# Altium schematic sheet IPBUS_mezzanine.SchDoc
size A3; SheetNumber: 1; SheetTotal: 1
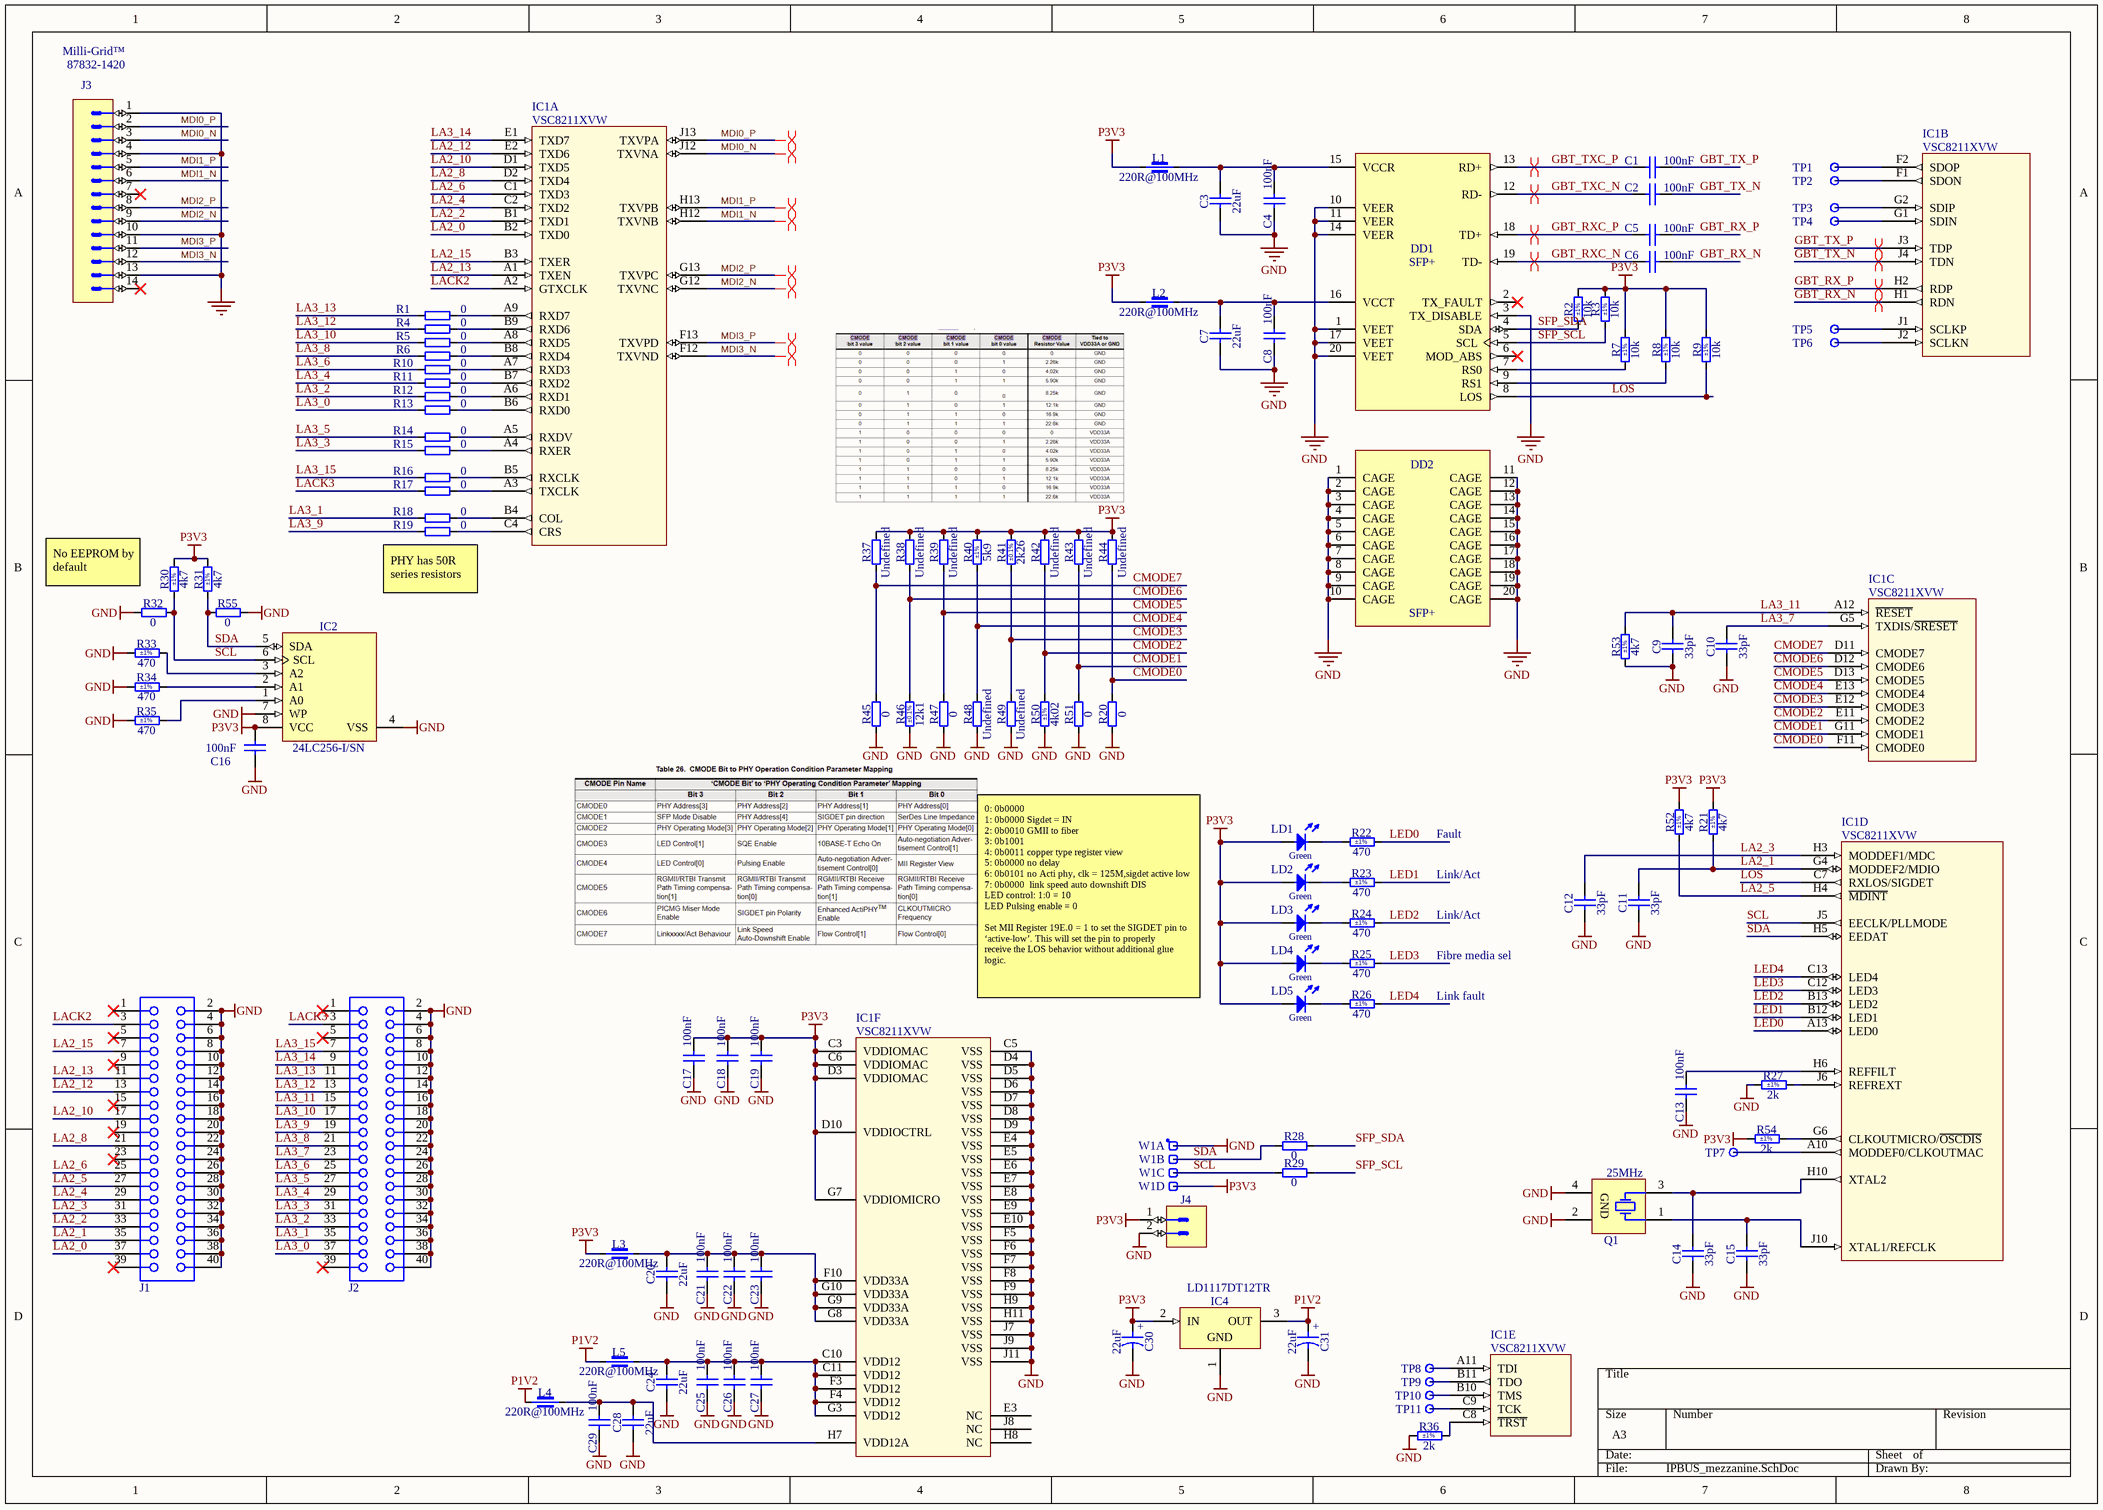
[diagram p0: IPBUS_mezzanine.SchDoc]

## Parts
C1  100nF  [CAPC1005X55N]
C2  100nF  [CAPC1005X55N]
C3  22uF  [CAPC3216X180N]
C4  100nF  [CAPC1005X55N]
C5  100nF  [CAPC1005X55N]
C6  100nF  [CAPC1005X55N]
C7  22uF  [CAPC3216X180N]
C8  100nF  [CAPC1005X55N]
C9  33pF  [CAPC1005X55N]
C10  33pF  [CAPC1005X55N]
C11  33pF  [CAPC1005X55N]
C12  33pF  [CAPC1005X55N]
C13  100nF  [CAPC1005X55N]
C14  33pF  [CAPC1005X55N]
C15  33pF  [CAPC1005X55N]
C16  100nF  [CAPC1005X55N]
C17  100nF  [CAPC1005X55N]
C18  100nF  [CAPC1005X55N]
C19  100nF  [CAPC1005X55N]
C20  22uF  [CAPC3216X180N]
C21  100nF  [CAPC1005X55N]
C22  100nF  [CAPC1005X55N]
C23  100nF  [CAPC1005X55N]
C24  22uF  [CAPC3216X180N]
C25  100nF  [CAPC1005X55N]
C26  100nF  [CAPC1005X55N]
C27  100nF  [CAPC1005X55N]
C28  22uF  [CAPC3216X180N]
C29  100nF  [CAPC1005X55N]
C30  22uF  [CAPMP3528X210N]
C31  22uF  [CAPMP3528X210N]
DD1  SFP+  [AMPHENOL_UE76A203000]
DD2  SFP+  [AMPHENOL_U77A16131001]
IC1  VSC8211XVW  [BGA117C100P13X9_1400X1000X170]  (parts A,B,C,D,E,F of 6)
IC2  24LC256-I/SN  [SOIC127P600X175-8N]
IC4  LD1117DT12TR  [TO228P972X240-3N-R540X510]
J1  61304021821  [61304021821]  (value not drawn)
J2  61304021821  [61304021821]  (value not drawn)
J3  Milli-Grid™  Manufacturer Part Number: 87832-1420  [MOLEX_87832-1420]
J4  KK®  [MOLEX_22-05-7028]  (value not drawn)
L1  220R@100MHz  [INDC1608X95N]
L2  220R@100MHz  [INDC1608X95N]
L3  220R@100MHz  [INDC1608X95N]
L4  220R@100MHz  [INDC1608X95N]
L5  220R@100MHz  [INDC1608X95N]
LD1  Green  [LED_AVAGO_HSME-C120]
LD2  Green  [LED_AVAGO_HSME-C120]
LD3  Green  [LED_AVAGO_HSME-C120]
LD4  Green  [LED_AVAGO_HSME-C120]
LD5  Green  [LED_AVAGO_HSME-C120]
Q1  25MHz  [XTAL_TXC_8Y]
R1  0  [RESC1005X40N]
R2  10k  Tolerance: ±1%  [RESC1608X55N]
R3  10k  Tolerance: ±1%  [RESC1608X55N]
R4  0  [RESC1005X40N]
R5  0  [RESC1005X40N]
R6  0  [RESC1005X40N]
R7  10k  Tolerance: ±1%  [RESC1608X55N]
R8  10k  Tolerance: ±1%  [RESC1608X55N]
R9  10k  Tolerance: ±1%  [RESC1608X55N]
R10  0  [RESC1005X40N]
R11  0  [RESC1005X40N]
R12  0  [RESC1005X40N]
R13  0  [RESC1005X40N]
R14  0  [RESC1005X40N]
R15  0  [RESC1005X40N]
R16  0  [RESC1005X40N]
R17  0  [RESC1005X40N]
R18  0  [RESC1005X40N]
R19  0  [RESC1005X40N]
R20  0  [RESC1608X55N]
R21  4k7  Tolerance: ±1%  [RESC1608X55N]
R22  470  Tolerance: ±1%  [RESC1608X55N]
R23  470  Tolerance: ±1%  [RESC1608X55N]
R24  470  Tolerance: ±1%  [RESC1608X55N]
R25  470  Tolerance: ±1%  [RESC1608X55N]
R26  470  Tolerance: ±1%  [RESC1608X55N]
R27  2k  Tolerance: ±1%  [RESC1608X55N]
R28  0  [RESC1608X55N]
R29  0  [RESC1608X55N]
R30  4k7  Tolerance: ±1%  [RESC1608X55N]
R31  4k7  Tolerance: ±1%  [RESC1608X55N]
R32  0  [RESC1608X55N]
R33  470  Tolerance: ±1%  [RESC1608X55N]
R34  470  Tolerance: ±1%  [RESC1608X55N]
R35  470  Tolerance: ±1%  [RESC1608X55N]
R36  2k  Tolerance: ±1%  [RESC1608X55N]
R37  Undefined  [RESC1608X55N]
R38  Undefined  [RESC1608X55N]
R39  Undefined  [RESC1608X55N]
R40  5k9  Tolerance: ±1%  [RESC1608X55N]
R41  2k26  Tolerance: ±0.1%  [RESC1608X55N]
R42  Undefined  [RESC1608X55N]
R43  Undefined  [RESC1608X55N]
R44  Undefined  [RESC1608X55N]
R45  0  [RESC1608X55N]
R46  12k1  Tolerance: ±0.1%  [RESC1608X55N]
R47  0  [RESC1608X55N]
R48  Undefined  [RESC1608X55N]
R49  Undefined  [RESC1608X55N]
R50  4k02  Tolerance: ±1%  [RESC1608X55N]
R51  0  [RESC1608X55N]
R52  4k7  Tolerance: ±1%  [RESC1608X55N]
R53  4k7  Tolerance: ±1%  [RESC1608X55N]
R54  2k  Tolerance: ±1%  [RESC1608X55N]
R55  0  [RESC1608X55N]
TP1  SMD Pad  [C60]  (value not drawn)
TP2  SMD Pad  [C60]  (value not drawn)
TP3  SMD Pad  [C60]  (value not drawn)
TP4  SMD Pad  [C60]  (value not drawn)
TP5  SMD Pad  [C60]  (value not drawn)
TP6  SMD Pad  [C60]  (value not drawn)
TP7  SMD Pad  [C60]  (value not drawn)
TP8  SMD Pad  [C60]  (value not drawn)
TP9  SMD Pad  [C60]  (value not drawn)
TP10  SMD Pad  [C60]  (value not drawn)
TP11  SMD Pad  [C60]  (value not drawn)
W1  Header 4  [SAMTEC_HTSW-104-23-L-S]  (value not drawn)  (parts A,B,C,D of 4)

## Nets
GND: C3.1 C4.1 C7.1 C8.1 C9.1 C10.1 C11.1 C12.1 C13.1 C14.1 C15.1 C16.1 C17.1 C18.1 C19.1 C20.1 C21.1 C22.1 C23.1 C24.1 C25.1 C26.1 C27.1 C28.1 C29.1 C30.2 C31.2 DD1.1(VEET) DD1.3(TX_DISABLE) DD1.10(VEER) DD1.11(VEER) DD1.14(VEER) DD1.17(VEET) DD1.20(VEET) DD2.1(CAGE) DD2.2(CAGE) DD2.3(CAGE) DD2.4(CAGE) DD2.5(CAGE) DD2.6(CAGE) DD2.7(CAGE) DD2.8(CAGE) DD2.9(CAGE) DD2.10(CAGE) DD2.11(CAGE) DD2.12(CAGE) DD2.13(CAGE) DD2.14(CAGE) DD2.15(CAGE) DD2.16(CAGE) DD2.17(CAGE) DD2.18(CAGE) DD2.19(CAGE) DD2.20(CAGE) IC1.C5(VSS) IC1.D4(VSS) IC1.D5(VSS) IC1.D6(VSS) IC1.D7(VSS) IC1.D8(VSS) IC1.D9(VSS) IC1.E4(VSS) IC1.E5(VSS) IC1.E6(VSS) IC1.E7(VSS) IC1.E8(VSS) IC1.E9(VSS) IC1.E10(VSS) IC1.F5(VSS) IC1.F6(VSS) IC1.F7(VSS) IC1.F8(VSS) IC1.F9(VSS) IC1.H9(VSS) IC1.H11(VSS) IC1.J7(VSS) IC1.J9(VSS) IC1.J11(VSS) IC2.4(VSS) IC2.7(WP) IC4.1(GND) J1.2 J1.4 J1.6 J1.8 J1.10 J1.12 J1.14 J1.16 J1.18 J1.20 J1.22 J1.24 J1.26 J1.28 J1.30 J1.32 J1.34 J1.36 J1.38 J1.40 J2.2 J2.4 J2.6 J2.8 J2.10 J2.12 J2.14 J2.16 J2.18 J2.20 J2.22 J2.24 J2.26 J2.28 J2.30 J2.32 J2.34 J2.36 J2.38 J2.40 J3.1 J3.4 J3.10 J3.13 J4.2 Q1.2(GND) Q1.4(GND) R20.1 R27.1 R32.1 R33.1 R34.1 R35.1 R36.1 R45.1 R46.1 R47.1 R48.1 R49.1 R50.1 R51.1 R53.1 R55.2 W1.1
P1V2: C31.1 IC4.3(OUT) L4.1 L5.1
P3V3: C16.2 C17.2 C18.2 C19.2 C30.1 IC1.C3(VDDIOMAC) IC1.C6(VDDIOMAC) IC1.D3(VDDIOMAC) IC1.D10(VDDIOCTRL) IC1.G7(VDDIOMICRO) IC2.8(VCC) IC4.2(IN) J4.1 L1.1 L2.1 L3.1 LD1.2(A) LD2.2(A) LD3.2(A) LD4.2(A) LD5.2(A) R2.2 R3.2 R7.2 R8.2 R9.2 R21.2 R30.2 R31.2 R37.2 R38.2 R39.2 R40.2 R41.2 R42.2 R43.2 R44.2 R52.2 R54.1 W1.4
CMODE0: IC1.F11(CMODE0) R20.2 R44.1
CMODE1: IC1.G11(CMODE1) R43.1 R51.2
CMODE2: IC1.E11(CMODE2) R42.1 R50.2
CMODE3: IC1.E12(CMODE3) R41.1 R49.2
CMODE4: IC1.E13(CMODE4) R40.1 R48.2
CMODE5: IC1.D13(CMODE5) R39.1 R47.2
CMODE6: IC1.D12(CMODE6) R38.1 R46.2
CMODE7: IC1.D11(CMODE7) R37.1 R45.2
GBT_RX_N: C6.2 IC1.H1(RDN)
GBT_RX_P: C5.2 IC1.H2(RDP)
GBT_RXC_N: C6.1 DD1.19(TD-)
GBT_RXC_P: C5.1 DD1.18(TD+)
GBT_TX_N: C2.2 IC1.J4(TDN)
GBT_TX_P: C1.2 IC1.J3(TDP)
GBT_TXC_N: C2.1 DD1.12(RD-)
GBT_TXC_P: C1.1 DD1.13(RD+)
LA2_0: IC1.B2(TXD0) J1.37
LA2_1: C11.2 IC1.G4(MODDEF2/MDIO) J1.35 R21.1
LA2_2: IC1.B1(TXD1) J1.33
LA2_3: C12.2 IC1.H3(MODDEF1/MDC) J1.31
LA2_4: IC1.C2(TXD2) J1.29
LA2_5: IC1.H4(~{MDINT}) J1.27 R52.1
LA2_6: IC1.C1(TXD3) J1.25
LA2_8: IC1.D2(TXD4) J1.21
LA2_10: IC1.D1(TXD5) J1.17
LA2_12: IC1.E2(TXD6) J1.13
LA2_13: IC1.A1(TXEN) J1.11
LA2_15: IC1.B3(TXER) J1.7
LA3_0: J2.37 R13.1
LA3_1: J2.35 R18.1
LA3_2: J2.33 R12.1
LA3_3: J2.31 R15.1
LA3_4: J2.29 R11.1
LA3_5: J2.27 R14.1
LA3_6: J2.25 R10.1
LA3_7: C10.2 IC1.G5(TXDIS/~{SRESET}) J2.23
LA3_8: J2.21 R6.1
LA3_9: J2.19 R19.1
LA3_10: J2.17 R5.1
LA3_11: C9.2 IC1.A12(~{RESET}) J2.15 R53.2
LA3_12: J2.13 R4.1
LA3_13: J2.11 R1.1
LA3_14: IC1.E1(TXD7) J2.9
LA3_15: J2.7 R16.1
LACK2: IC1.A2(GTXCLK) J1.3
LACK3: J2.3 R17.1
LED0: IC1.A13(LED0) R22.2
LED1: IC1.B12(LED1) R23.2
LED2: IC1.B13(LED2) R24.2
LED3: IC1.C12(LED3) R25.2
LED4: IC1.C13(LED4) R26.2
LOS: DD1.8(LOS) IC1.C7(RXLOS/SIGDET) R9.1
MDI0_N: IC1.J12(TXVNA) J3.3
MDI0_P: IC1.J13(TXVPA) J3.2
MDI1_N: IC1.H12(TXVNB) J3.6
MDI1_P: IC1.H13(TXVPB) J3.5
MDI2_N: IC1.G12(TXVNC) J3.9
MDI2_P: IC1.G13(TXVPC) J3.8
MDI3_N: IC1.F12(TXVND) J3.12
MDI3_P: IC1.F13(TXVPD) J3.11
SCL: IC1.J5(EECLK/PLLMODE) IC2.6(SCL) R29.1 R30.1 R32.2 W1.3
SDA: IC1.H5(EEDAT) IC2.5(SDA) R28.1 R31.1 R55.1 W1.2
SFP_SCL: DD1.5(SCL) R3.1 R29.2
SFP_SDA: DD1.4(SDA) R2.1 R28.2
NetC3_2: C3.2 C4.2 DD1.15(VCCR) L1.2
NetC7_2: C7.2 C8.2 DD1.16(VCCT) L2.2
NetC13_2: C13.2 IC1.H6(REFFILT)
NetC14_2: C14.2 IC1.H10(XTAL2) Q1.3(X)
NetC15_2: C15.2 IC1.J10(XTAL1/REFCLK) Q1.1(X)
NetC20_2: C20.2 C21.2 C22.2 C23.2 IC1.F10(VDD33A) IC1.G8(VDD33A) IC1.G9(VDD33A) IC1.G10(VDD33A) L3.2
NetC24_2: C24.2 C25.2 C26.2 C27.2 IC1.C10(VDD12) IC1.C11(VDD12) IC1.F3(VDD12) IC1.F4(VDD12) IC1.G3(VDD12) L5.2
NetC28_2: C28.2 C29.2 IC1.H7(VDD12A) L4.2
NetDD1_7: DD1.7(RS0) R7.1
NetDD1_9: DD1.9(RS1) R8.1
NetIC1_A3: IC1.A3(TXCLK) R17.2
NetIC1_A4: IC1.A4(RXER) R15.2
NetIC1_A5: IC1.A5(RXDV) R14.2
NetIC1_A6: IC1.A6(RXD1) R12.2
NetIC1_A7: IC1.A7(RXD3) R10.2
NetIC1_A8: IC1.A8(RXD5) R5.2
NetIC1_A9: IC1.A9(RXD7) R1.2
NetIC1_A10: IC1.A10(MODDEF0/CLKOUTMAC) TP7.1
NetIC1_A11: IC1.A11(TDI) TP8.1
NetIC1_B4: IC1.B4(COL) R18.2
NetIC1_B5: IC1.B5(RXCLK) R16.2
NetIC1_B6: IC1.B6(RXD0) R13.2
NetIC1_B7: IC1.B7(RXD2) R11.2
NetIC1_B8: IC1.B8(RXD4) R6.2
NetIC1_B9: IC1.B9(RXD6) R4.2
NetIC1_B10: IC1.B10(TMS) TP10.1
NetIC1_B11: IC1.B11(TDO) TP9.1
NetIC1_C4: IC1.C4(CRS) R19.2
NetIC1_C8: IC1.C8(~{TRST}) R36.2
NetIC1_C9: IC1.C9(TCK) TP11.1
NetIC1_F1: IC1.F1(SDON) TP2.1
NetIC1_F2: IC1.F2(SDOP) TP1.1
NetIC1_G1: IC1.G1(SDIN) TP4.1
NetIC1_G2: IC1.G2(SDIP) TP3.1
NetIC1_G6: IC1.G6(CLKOUTMICRO/~{OSCDIS}) R54.2
NetIC1_J1: IC1.J1(SCLKP) TP5.1
NetIC1_J2: IC1.J2(SCLKN) TP6.1
NetIC1_J6: IC1.J6(REFREXT) R27.2
NetIC2_1: IC2.1(A0) R35.2
NetIC2_2: IC2.2(A1) R34.2
NetIC2_3: IC2.3(A2) R33.2
NetLD1_1: LD1.1(C) R22.1
NetLD2_1: LD2.1(C) R23.1
NetLD3_1: LD3.1(C) R24.1
NetLD4_1: LD4.1(C) R25.1
NetLD5_1: LD5.1(C) R26.1

Not connected (* = marked no-connect by the designer): DD1 2(TX_FAULT)* 6(MOD_ABS)*; IC1 E3(NC) H8(NC) J8(NC); J1 1* 5* 9* 15* 19* 23* 39*; J2 1* 5* 39*; J3 7* 14*

## Layout directives
differential pair: GBT_RX_N, GBT_RX_P, GBT_RXC_N, GBT_RXC_P, GBT_TX_N, GBT_TX_P, GBT_TXC_N, GBT_TXC_P, MDI0_N, MDI0_P, MDI1_N, MDI1_P, MDI2_N, MDI2_P, MDI3_N, MDI3_P

## Notes on the sheet
- No EEPROM by default
- (near R19) PHY has 50R series resistors
- Fault
- Link/Act
- 0: 0b0000
  1: 0b0000 Sigdet = IN
  2: 0b0010 GMII to fiber
  3: 0b1001
  4: 0b0011 copper type register view
  5: 0b0000 no delay
  6: 0b0101 no Acti phy, clk = 125M,sigdet active low
  7: 0b0000  link speed auto downshift DIS
  LED control: 1:0 = 10
  LED Pulsing enable = 0
  Set MII Register 19E.0 = 1 to set the SIGDET pin to ‘active-low’. This will set the pin to properly
  receive the LOS behavior without additional glue logic.
- Fibre media sel
- Link fault
- (in symbol CTE3528-21_22UF_10V_10%_LESR0700) +

## Library data of the parts
C1 C2 C4-C6 C8 C13 C16-C19 C21-C23 C25-C27 C29 = CC0402_100NF_16V_10%_X5R: Non-polarised capacitor; Part Description: SMD Multilayer Chip Ceramic Capacitor; Manufacturer: GENERIC; Manufacturer1 Part Number: GRM155R61C104KA88D; Voltage: 16V; TC: X5R; Tolerance: ±10%; Part Number: CC0402_100NF_16V_10%_X5R; Component Kind: Standard; Component Type: Standard; Pin Count: 2; Value: 100nF; Status: None; Manufacturer Part Number: CC0402_100NF_16V_10%_X5R; Case: 0402; Mounted: Yes; Socket: No; SMD: Yes; Sense: No; Manufacturer1 Example: MURATA; Manufacturer1 ComponentHeight: 0.55mm; HelpURL: \\cern.ch\dfs\Applications\Altium\Datasheets\CC0402_X5R_MURATA_GRM.pdf; Author: CERN DEM JLC; CreateDate: 10.12.2013; LatestRevisionDate: 10.12.2013
C3 C7 C20 C24 C28 = CC1206_22UF_25V_20%_X5R: Non-polarised capacitor; Part Description: SMD Multilayer Chip Ceramic Capacitor; Manufacturer: GENERIC; Manufacturer1 Part Number: C3216X5R1E226M160; Voltage: 25V; TC: X5R; Tolerance: ±20%; Part Number: CC1206_22UF_25V_20%_X5R; Component Kind: Standard; Component Type: Standard; Pin Count: 2; Value: 22uF; Status: None; Manufacturer Part Number: CC1206_22UF_25V_20%_X5R; Case: 1206; Mounted: Yes; Socket: No; SMD: Yes; Sense: No; Manufacturer1 Example: TDK; Manufacturer1 ComponentHeight: 1.8mm; HelpURL: \\cern.ch\dfs\Applications\Altium\Datasheets\CC1206_X5R_TDK_C.pdf; Author: CERN DEM WB; CreateDate: 25.07.2018; LatestRevisionDate: 25.07.2018
C9-C12 C14 C15 = CC0402_33PF_50V_5%_C0G: Non-polarised capacitor; Part Description: SMD Multilayer Chip Ceramic Capacitor; Manufacturer: GENERIC; Manufacturer1 Part Number: C0402C330J5GACTU; Voltage: 50V; TC: C0G/NP0; Tolerance: ±5%; Part Number: CC0402_33PF_50V_5%_C0G; Component Kind: Standard; Component Type: Standard; Pin Count: 2; Value: 33pF; Status: Preferred; Manufacturer Part Number: CC0402_33PF_50V_5%_C0G; Case: 0402; Mounted: Yes; Socket: No; SMD: Yes; Sense: No; Manufacturer1 Example: KEMET; Manufacturer1 ComponentHeight: 0.55mm; HelpURL: \\cern.ch\dfs\Applications\Altium\Datasheets\CC0402_C0G_KEMET_(Commercial Grade).pdf; Author: CERN DEM JLC; CreateDate: 03.12.2007; LatestRevisionDate: 22.04.2015
C30 C31 = CTE3528-21_22UF_10V_10%_LESR0700: Polarised capacitor; Part Description: Low ESR 0R7 Solid Tantalum Chip Capacitor; Manufacturer: GENERIC; Manufacturer1 Part Number: TPSB226K010R0700; Voltage: 10V; Tolerance: ±10%; Part Number: CTE3528-21_22UF_10V_10%_LESR0700; Component Kind: Standard; Component Type: Standard; Pin Count: 2; Value: 22uF; Status: Preferred; Manufacturer Part Number: CTE3528-21_22UF_10V_10%_LESR0700; Case: B; Mounted: Yes; Socket: No; SMD: Yes; Sense: No; Manufacturer1 Example: AVX; Manufacturer1 ComponentHeight: 2.1mm; HelpURL: \\cern.ch\dfs\Applications\Altium\Datasheets\CTE-LESR_AVX_TPS.pdf; Author: CERN DEM JLC; CreateDate: 05.05.2008; LatestRevisionDate: 20.01.2009
DD1 = AMPHENOL_UE76A203000: 20 Position SFP+ Connector (Small Form-factor Pluggable); Part Description: 20 Position, Pitch 0.8mm SFP+ High Speed Connector Receptacle (Small Form-factor Pluggable); PressFit: No; Part Number: AMPHENOL_UE76A203000; Component Kind: Standard; Component Type: Standard; Pin Count: 20; Family: SFP+; Mounted: Yes; Socket: No; SMD: Yes; Sense: No; Status: None; Manufacturer: AMPHENOL; Manufacturer Part Number: UE76A203000; ComponentHeight: 5.25mm; HelpURL: \\cern.ch\dfs\Applications\Altium\Datasheets\AMPHENOL_UE76A203000.pdf; Author: CERN DEM BC; CreateDate: 04.09.2020; LatestRevisionDate: 04.09.2020
DD2 = AMPHENOL_U77A16131001: SFP+ 1x1 Cage (20Pins); Part Description: 1x1 Cage For Use with SFP+ Connector (Small Form-factor Pluggable); PressFit: No; Part Number: AMPHENOL_U77A16131001; Component Kind: Standard; Component Type: Standard; Pin Count: 20; Family: SFP+; Mounted: Yes; Socket: No; SMD: No; Sense: No; Status: None; Manufacturer: AMPHENOL; Manufacturer Part Number: U77A16131001; ComponentHeight: 9.7mm; HelpURL: \\cern.ch\dfs\Applications\Altium\Datasheets\AMPHENOL_U77A16131001.pdf; Author: CERN DEM BC; CreateDate: 03.09.2020; LatestRevisionDate: 03.09.2020
IC1 = VSC8211XVW: Single Port 10/100/1000BASE-T PHY and 1000BASE-X PHY with SGMII, SerDes, GMII, MII, TBI, RGMII / RTBI MAC Interfaces; Manufacturer: VITESSE SEMICONDUCTOR; PressFit: No; Bonding: No; Part Number: VSC8211XVW; Component Kind: Standard; Component Type: Standard; Device: VSC8211XVW; PackageDescription: BGA, 1.00mm Pitch, Rect.; 117 Pin, 13 Columns X 9 Rows, 14.0mm L X 10.0mm W X 1.70mm H body, IPC Medium Density; Part Description: Single Port 10/100/1000BASE-T PHY and 1000BASE-X PHY with SGMII, SerDes, GMII, MII, TBI, RGMII / RTBI MAC Interfaces; Manufacturer Part Number: VSC8211XVW; Pin Count: 117; Case: BGA117; Mounted: Yes; Socket: No; SMD: Yes; Sense: No; ComponentHeight: 1.7mm; Author: CERN DEM JLC; HelpURL: \\cern.ch\dfs\Applications\Altium\Datasheets\VSC8211XVW.pdf; CreateDate: 16.08.2011; LatestRevisionDate: 16.08.2011
IC2 = 24LC256-I/SN: 2.5V-5.5V, 256K (32k x 8-bit) I2C Serial EEPROM; Manufacturer: MICROCHIP TECHNOLOGY; PressFit: No; Bonding: No; Part Number: 24LC256-I/SN; Component Kind: Standard; Component Type: Standard; Device: 24LC256-I/SN; PackageDescription: SOIC, 1.27mm Pitch; 8 Pin - Body 4x5mm, IPC Medium Density; Part Description: 2.5V-5.5V, 256K (32k x 8-bit) I2C Serial EEPROM; Manufacturer Part Number: 24LC256-I/SN; Pin Count: 8; Case: SOIC8; Mounted: Yes; Socket: No; SMD: Yes; Sense: No; ComponentHeight: 1.75mm; HelpURL: \\cern.ch\dfs\Applications\Altium\Datasheets\24LC256-I-SN.pdf; Author: CERN DEM JLC; CreateDate: 04.09.2012; LatestRevisionDate: 04.09.2012
IC4 = LD1117DT12TR: 3-Terminal Regulator 1=GND 2=IN 3=OUT; Part Description: 1.2V 800mA Low drop fixed and adjustable positive voltage regulators; Manufacturer: ST MICROELECTRONICS; PressFit: No; Bonding: No; Part Number: LD1117DT12TR; Component Kind: Standard; Component Type: Standard; Device: LD1117DT12TR; PackageDescription: TO-252 DPAK TO, 2.28mm Pitch; 2 Pin, 9.725mm L X 6.10mm W X 2.40mm H body, IPC Medium Density; Manufacturer Part Number: LD1117DT12TR; Pin Count: 3; Case: DPAK; Mounted: Yes; Socket: No; SMD: Yes; Sense: No; ComponentHeight: 2.4mm; HelpURL: \\cern.ch\dfs\Applications\Altium\Datasheets\LD1117DT12TR.pdf; Author: CERN DEM JLC; CreateDate: 02.09.2009; LatestRevisionDate: 21.09.2009
J1 J2 = 61304021821: WR-PHD Socket Header, THT, Vertical, pitch 2.54mm, 2 Row, 40P; Manufacturer: Wurth Elektronik; Contact Resistance: 20mOhm; Rated Current: 3A; Working Voltage: 250V; Withstanding Voltage: 500V; Manufacturer Part Number: 61304021821; Category: Board-to-Board Connectors; Match Code: WR-PHD; ComponentLink1Description: Website Link; ComponentLink1URL: https://www.we-online.com/redexpert/article/61304021821?ad; ComponentLink2Description: Datasheet Link; ComponentLink2URL: https://www.we-online.com/redexpert/spec/61304021821?ad; Mount: Through Hole; Operating Temperature Max: 125°C; Operating Temperature Min: -40°C; Packaging: Tray; Gender: Socket Header; Number of Pins: 40; Number of Rows: 2; Orientation: Vertical; Pitch: 2.54mm
J3 = MOLEX_87832-1420: Connector 14 Male; Manufacturer: MOLEX; Part Description: 2.00mm (.079") Pitch Milli-Grid™ Header, Surface Mount, Vertical, Shrouded, 14 Circuits,with Locking Windows and Centre Polarization Slot, PCB Locator; PressFit: No; Part Number: MOLEX_87832-1420; Component Kind: Standard; Component Type: Standard; Pin Count: 14; Family: Milli-Grid™; Mounted: Yes; Socket: No; SMD: Yes; Sense: No; Status: None; ComponentHeight: 7.6mm; HelpURL: \\cern.ch\dfs\Applications\Altium\Datasheets\MOLEX_87832-1420.pdf; Author: CERN DEM JLC; CreateDate: 09.09.2008; LatestRevisionDate: 09.09.2008
J4 = MOLEX_22-05-7028: Connector 2 Male; Part Description: 2.54mm (.100") Pitch KK® Wire-To-Board Header, Right Angle, with Friction Lock, 2 Circuits; Manufacturer: MOLEX; PressFit: No; Part Number: MOLEX_22-05-7028; Component Kind: Standard; Component Type: Standard; Pin Count: 2; Family: KK®; Mounted: Yes; Socket: No; SMD: No; Sense: No; Status: None; Manufacturer Part Number: 22-05-7028; ComponentHeight: 5.8mm; HelpURL: \\cern.ch\dfs\Applications\Altium\Datasheets\MOLEX_22-05-7028.pdf; Author: CERN DEM JLC; CreateDate: 24.01.2011; LatestRevisionDate: 24.01.2011
L1-L5 = IND0603_MURATA_BLM18SG221TN1: Part Description: SMD EMIFIL Suppression Chip Ferrite Bead; Manufacturer: MURATA; Power: 2.5A; Resistance: 0.04R; Tolerance: ±25%; Part Number: IND0603_MURATA_BLM18SG221TN1; Component Kind: Standard; Component Type: Standard; Pin Count: 2; Value: 220R@100MHz; Manufacturer Part Number: BLM18SG221TN1; Case: 0603; Mounted: Yes; Socket: No; SMD: Yes; Sense: No; ComponentHeight: 0.95mm; HelpURL: \\cern.ch\dfs\Applications\Altium\Datasheets\IND0603_MURATA_BLM18S.pdf; Author: CERN DEM MR; CreateDate: 08.01.2016; LatestRevisionDate: 25.10.2018
LD1-LD5 = LED_AVAGO_HSME-C120: LED Green 1C 2A; Part Description: High Performance Right Angle Chip Green LED; Manufacturer: AVAGO TECHNOLOGIES; PressFit: No; Bonding: No; Part Number: LED_AVAGO_HSME-C120; Component Kind: Standard; Component Type: Standard; Color: Green; PackageDescription: Green Chip LED, 2-Leads, Body 1.7x1.1mm, Side Emitting Package; Manufacturer Part Number: HSME-C120; Pin Count: 2; Mounted: Yes; Socket: No; SMD: Yes; Sense: No; ComponentHeight: 0.7mm; HelpURL: \\cern.ch\dfs\Applications\Altium\Datasheets\LED_AVAGO_HSME-C120.pdf; ComponentLink1URL: \\cern.ch\dfs\Applications\Altium\Datasheets\LED_AVAGO_HSME-C110_DESIGN-GUIDE.pdf; ComponentLink1Description: Design Guide; Author: CERN DEM JMW; CreateDate: 22.07.2009; LatestRevisionDate: 20.06.2012
Q1 = XTAL_25MHZ_TXC_8Y-25.000MAAJ-T: Crystal 4 pins 1=XTAL Control 2=GND3=XTAL 4=GND; Part Description: ±30ppm, 18pF, -20°C to +70°C  4 Pins, 2x1.6X0.5mm, SMD Seam Sealing Crystal, 8Y Serie; Manufacturer: TXC CORPORATION; PressFit: No; Bonding: No; Part Number: XTAL_25MHZ_TXC_8Y-25.000MAAJ-T; Component Kind: Standard; Component Type: Standard; PackageDescription: 4 Pins, 2x1.6X0.5mm, SMD Seam Sealing Crystal, 8Y Serie; Value: 25MHz; Manufacturer Part Number: 8Y-25.000MAAJ-T; Pin Count: 4; Mounted: Yes; Socket: No; SMD: Yes; Sense: No; ComponentHeight: 13.6mm; HelpURL: \\cern.ch\dfs\Applications\Altium\Datasheets\XTAL_TXC_8Y.pdf; Author: CERN DEM JLC; CreateDate: 08.03.2012; LatestRevisionDate: 08.03.2012
R1 R4-R6 R10-R19 = R0402_0R_JUMPER: Resistor; Part Description: 1A (0.05R Max DC Resistance) Zero Ohm Jumper; Manufacturer: GENERIC; Manufacturer1 Part Number: 232270591001L; PressFit: No; Part Number: R0402_0R_JUMPER; Component Kind: Standard; Component Type: Standard; Pin Count: 2; Value: 0; Status: Not Recommended; Manufacturer Part Number: R0402_0R_JUMPER; Case: 0402; Mounted: Yes; Sense: No; Socket: No; SMD: Yes; Manufacturer1 Example: YAGEO PHYCOMP; Manufacturer1 ComponentHeight: 0.4mm; HelpURL: \\cern.ch\dfs\Applications\Altium\Datasheets\R0402_Phycomp_RC0402.pdf; Author: CERN DEM JLC; CreateDate: 03.12.2007; LatestRevisionDate: 17.10.2012
R2 R3 R7-R9 = R0603_10K_1%_0.1W_100PPM: Resistor - 1%; Part Description: General Purpose Thick Film Chip Resistor; Manufacturer: GENERIC; Manufacturer1 Part Number: NRC06F1002TRF; Power: 0.1W; TC: ±100ppm/°C; PressFit: No; Part Number: R0603_10K_1%_0.1W_100PPM; Component Kind: Standard; Component Type: Standard; Pin Count: 2; Value: 10k; Status: Preferred; Manufacturer Part Number: R0603_10K_1%_0.1W_100PPM; Case: 0603; Mounted: Yes; Sense: No; Socket: No; SMD: Yes; Manufacturer1 Example: NIC COMPONENT; Manufacturer1 ComponentHeight: 0.55mm; HelpURL: \\cern.ch\dfs\Applications\Altium\Datasheets\R0603_NIC_NRC.pdf; Author: CERN DEM JLC; CreateDate: 03.12.2007; LatestRevisionDate: 13.03.2008
R20 R28 R29 R32 R45 R47 R51 R55 = R0603_0R_JUMPER: Resistor; Part Description: 1A (0.05R Max DC Resistance) Zero Ohm Jumper; Manufacturer: GENERIC; Manufacturer1 Part Number: NRC06Z0; PressFit: No; Part Number: R0603_0R_JUMPER; Component Kind: Standard; Component Type: Standard; Pin Count: 2; Value: 0; Status: Preferred; Manufacturer Part Number: R0603_0R_JUMPER; Case: 0603; Mounted: Yes; Sense: No; Socket: No; SMD: Yes; Manufacturer1 Example: NIC COMPONENT; Manufacturer1 ComponentHeight: 0.55mm; HelpURL: \\cern.ch\dfs\Applications\Altium\Datasheets\R0603_NIC_NRC.pdf; Author: CERN DEM JLC; CreateDate: 03.12.2007; LatestRevisionDate: 13.03.2008
R21 R30 R31 R52 R53 = R0603_4K7_1%_0.1W_100PPM: Resistor - 1%; Part Description: General Purpose Thick Film Chip Resistor; Manufacturer: GENERIC; Manufacturer1 Part Number: NRC06F4701TRF; Power: 0.1W; TC: ±100ppm/°C; PressFit: No; Part Number: R0603_4K7_1%_0.1W_100PPM; Component Kind: Standard; Component Type: Standard; Pin Count: 2; Value: 4k7; Status: Preferred; Manufacturer Part Number: R0603_4K7_1%_0.1W_100PPM; Case: 0603; Mounted: Yes; Sense: No; Socket: No; SMD: Yes; Manufacturer1 Example: NIC COMPONENT; Manufacturer1 ComponentHeight: 0.55mm; HelpURL: \\cern.ch\dfs\Applications\Altium\Datasheets\R0603_NIC_NRC.pdf; Author: CERN DEM JLC; CreateDate: 03.12.2007; LatestRevisionDate: 13.03.2008
R22-R26 R33-R35 = R0603_470R_1%_0.1W_100PPM: Resistor - 1%; Part Description: General Purpose Thick Film Chip Resistor; Manufacturer: GENERIC; Manufacturer1 Part Number: NRC06F4700TRF; Power: 0.1W; TC: ±100ppm/°C; PressFit: No; Part Number: R0603_470R_1%_0.1W_100PPM; Component Kind: Standard; Component Type: Standard; Pin Count: 2; Value: 470; Status: Preferred; Manufacturer Part Number: R0603_470R_1%_0.1W_100PPM; Case: 0603; Mounted: Yes; Sense: No; Socket: No; SMD: Yes; Manufacturer1 Example: NIC COMPONENT; Manufacturer1 ComponentHeight: 0.55mm; HelpURL: \\cern.ch\dfs\Applications\Altium\Datasheets\R0603_NIC_NRC.pdf; Author: CERN DEM JLC; CreateDate: 03.12.2007; LatestRevisionDate: 13.03.2008
R27 R36 R54 = R0603_2K_1%_0.1W_100PPM: Resistor - 1%; Part Description: General Purpose Thick Film Chip Resistor; Manufacturer: GENERIC; Manufacturer1 Part Number: NRC06F2001TRF; Power: 0.1W; TC: ±100ppm/°C; PressFit: No; Part Number: R0603_2K_1%_0.1W_100PPM; Component Kind: Standard; Component Type: Standard; Pin Count: 2; Value: 2k; Status: Preferred; Manufacturer Part Number: R0603_2K_1%_0.1W_100PPM; Case: 0603; Mounted: Yes; Sense: No; Socket: No; SMD: Yes; Manufacturer1 Example: NIC COMPONENT; Manufacturer1 ComponentHeight: 0.55mm; HelpURL: \\cern.ch\dfs\Applications\Altium\Datasheets\R0603_NIC_NRC.pdf; Author: CERN DEM JLC; CreateDate: 03.12.2007; LatestRevisionDate: 13.03.2008
R37-R39 R42-R44 R48 R49 = R0603_NO-VALUE: Resistor; Part Description: Reserved Footprint For a 0603 (1608) Chip Resistor; PressFit: No; Mounted: No; Part Number: R0603_NO-VALUE; Component Kind: Standard; Component Type: Standard; Pin Count: 2; Value: Undefined; Status: None; Manufacturer: Undefined; Manufacturer Part Number: R0603_NO-VALUE; Case: 0603; Sense: No; Socket: No; SMD: Yes; Manufacturer1 Example: Undefined; Manufacturer1 Part Number: Undefined; Manufacturer1 ComponentHeight: Undefined; HelpURL: Undefined; Author: CERN DEM JLC; CreateDate: 03.12.2007; LatestRevisionDate: 13.03.2008
R40 = R0603_5K9_1%_0.1W_100PPM: Resistor - 1%; Part Description: General Purpose Thick Film Chip Resistor; Manufacturer: GENERIC; Manufacturer1 Part Number: CRCW06035K90FKEA; PressFit: No; Power: 0.1W; TC: ±100ppm/°C; Part Number: R0603_5K9_1%_0.1W_100PPM; Component Kind: Standard; Component Type: Standard; Pin Count: 2; Value: 5k9; Status: Preferred; Manufacturer Part Number: R0603_5K9_1%_0.1W_100PPM; Case: 0603; Mounted: Yes; Sense: No; Socket: No; SMD: Yes; Manufacturer1 Example: VISHAY; Manufacturer1 ComponentHeight: 0.55mm; HelpURL: \\cern.ch\dfs\Applications\Altium\Datasheets\R0603_VISHAY_CRCW e3.pdf; Author: CERN DEM JLC; CreateDate: 20.03.2014; LatestRevisionDate: 20.03.2014
R41 = R0603_2K26_0.1%_0.063W_10PPM: Resistor - 0.1%; Part Description: Thin Film Chip Resistor; Manufacturer: GENERIC; Manufacturer1 Part Number: RN73C1J2K26BTDF; PressFit: No; Power: 0.063W; TC: ±10ppm; Part Number: R0603_2K26_0.1%_0.063W_10PPM; Component Kind: Standard; Component Type: Standard; Pin Count: 2; Value: 2k26; Status: Not Recommended; Manufacturer Part Number: R0603_2K26_0.1%_0.063W_10PPM; Case: 0603; Mounted: Yes; Sense: No; Socket: No; SMD: Yes; Manufacturer1 Example: TYCO HOLSWORTHY; Manufacturer1 ComponentHeight: 0.5mm; HelpURL: \\cern.ch\dfs\Applications\Altium\Datasheets\R0603_Tyco_RN73.pdf; Author: CERN DEM JLC; CreateDate: 03.12.2007; LatestRevisionDate: 13.03.2008
R46 = R0603_12K1_0.1%_0.063W_10PPM: Resistor - 0.1%; Part Description: Thin Film Chip Resistor; Manufacturer: GENERIC; Manufacturer1 Part Number: RN73C1J12K1BTDF; PressFit: No; Power: 0.063W; TC: ±10ppm; Part Number: R0603_12K1_0.1%_0.063W_10PPM; Component Kind: Standard; Component Type: Standard; Pin Count: 2; Value: 12k1; Status: Not Recommended; Manufacturer Part Number: R0603_12K1_0.1%_0.063W_10PPM; Case: 0603; Mounted: Yes; Sense: No; Socket: No; SMD: Yes; Manufacturer1 Example: TYCO HOLSWORTHY; Manufacturer1 ComponentHeight: 0.5mm; HelpURL: \\cern.ch\dfs\Applications\Altium\Datasheets\R0603_Tyco_RN73.pdf; Author: CERN DEM JLC; CreateDate: 03.12.2007; LatestRevisionDate: 13.03.2008
R50 = R0603_4K02_1%_0.1W_100PPM: Resistor - 1%; Part Description: General Purpose Thick Film Chip Resistor; Manufacturer: GENERIC; Manufacturer1 Part Number: RC0603FR-074K02L; PressFit: No; Power: 0.1W; TC: ±100ppm/°C; Part Number: R0603_4K02_1%_0.1W_100PPM; Component Kind: Standard; Component Type: Standard; Pin Count: 2; Value: 4k02; Status: Preferred; Manufacturer Part Number: R0603_4K02_1%_0.1W_100PPM; Case: 0603; Mounted: Yes; Sense: No; Socket: No; SMD: Yes; Manufacturer1 Example: YAGEO PHYCOMP; Manufacturer1 ComponentHeight: 0.55mm; HelpURL: \\cern.ch\dfs\Applications\Altium\Datasheets\R0603_PHYCOMP_RC_L.pdf; Author: CERN DEM BC; CreateDate: 13.07.2020; LatestRevisionDate: 13.07.2020
TP1-TP11 = SMD_PAD_D0.6MM: Test Point; Part Description: 0.6mm Diameter SMD Pad; Mounted: No; Part Number: SMD_PAD_D0.6MM; Component Kind: Standard (No BOM); Component Type: Standard (No BOM); Pin Count: 1; Family: SMD Pad; Socket: No; SMD: Yes; Sense: No; Status: None; ComponentHeight: 0mm; HelpURL: Undefined; Author: CERN DEM HF; CreateDate: 22.11.2023; LatestRevisionDate: 22.11.2023; PackageDescription: 0.6mm Diameter SMD Pad
W1 = SAMTEC_HTSW-104-23-L-S: 4 Mini Wire-Wrap Contact Strip Header; Part Description: 4 Contacts, Pitch 2.54mm, Single Row  Through Mount Straight Header (Post Lead 5.84mm, Tail Lead 2.92mm, Insulator 2.54mm); Manufacturer: SAMTEC; PressFit: No; Status Comment: High Temperature; Part Number: SAMTEC_HTSW-104-23-L-S; Component Kind: Standard; Component Type: Standard; Pin Count: 4; Family: Header 4; Mounted: Yes; Socket: No; SMD: No; Sense: No; Status: Preferred; Manufacturer Part Number: HTSW-104-23-L-S; ComponentHeight: 8.38mm; HelpURL: \\cern.ch\dfs\Applications\Altium\Datasheets\SAMTEC_HTSW-104-23-L-S.pdf; Author: CERN DEM JLC; CreateDate: 22.02.2018; LatestRevisionDate: 22.02.2018